# EAGLE schematic tiny_function_generator_w_output_filter (EAGLE 7.7.0)
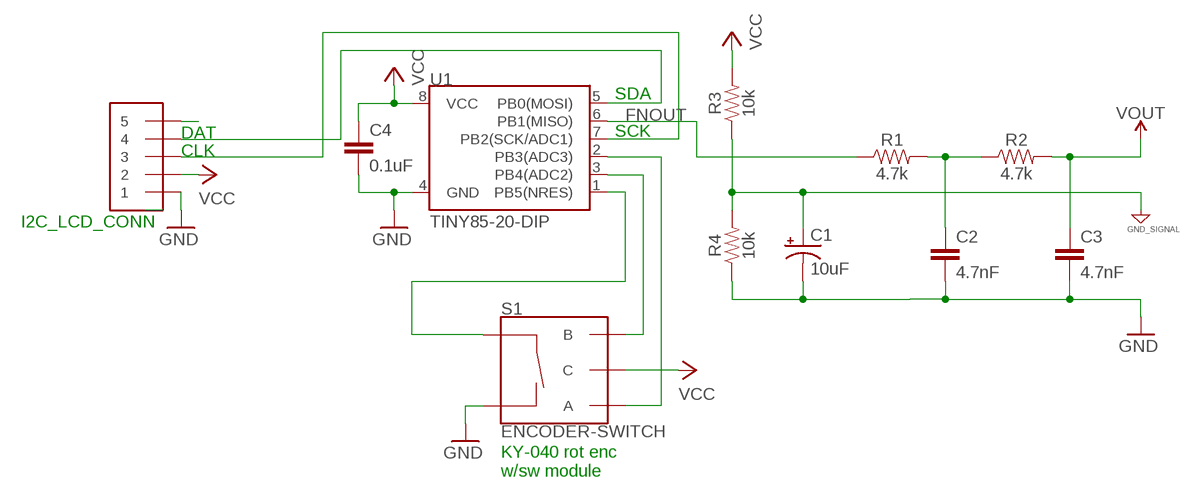
[diagram p0: schematic, sheet 1]

## Parts
C1  10uF  10UF-POLAR-RADIAL-2.5MM-25V-20%  [CPOL-RADIAL-2.5MM-5MM]
C2  4.7nF  4.7NF-50V-10%(0603)  [0603]
C3  4.7nF  4.7NF-50V-10%(0603)  [0603]
C4  0.1uF  0.1UF-KIT-EZ-50V-20%  [CAP-PTH-SMALL-KIT]
J1  1X5  [3.5MM-5P]
R1  4.7k  4.7KOHM-0603-1/10W-1%  [0603]
R2  4.7k  4.7KOHM-0603-1/10W-1%  [0603]
R3  10k  10KOHM-HORIZ-1/6W-5%  [AXIAL-0.3]
R4  10k  10KOHM-HORIZ-1/6W-5%  [AXIAL-0.3]
S1  ENCODER-SWITCH  [ROTARY_ENC_PLAIN]
U1  TINY85-20-DIP  ATTINY45TINY85-20-DIP  [DIP08_MCU]

## Nets
AGND: C1.1(+) R3.P$1 R4.P$2 ; supply symbol labelled GND_SIGNAL
FNOUT: R1.1 U1.6(PB1(MISO))
GND: C1.2(-) C2.2 C3.2 C4.2 J1.1 R4.P$1 S1.SW- U1.4(GND)
N$1: J1.3 U1.7(PB2(SCK/ADC1))
N$2: J1.4 U1.5(PB0(MOSI))
N$3: C2.1 R1.2 R2.1
N$5: S1.A U1.2(PB3(ADC3))
N$6: S1.B U1.3(PB4(ADC2))
N$7: S1.SW+ U1.1(PB5(NRES))
N$9: J1.5
VCC: C4.1 J1.2 R3.P$2 S1.C U1.8(VCC)
VOUT: C3.1 R2.2

## Notes on the sheet
- SDA
- DAT | SCK
- CLK
- I2C_LCD_CONN
- KY-040 rot enc 
  w/sw module

## Library data of the parts
C1 = SparkFun-Capacitors:10UF-POLAR: 10.0µF polarized capacitors A capacitor is a passive two-terminal electrical component used to store electrical energy temporarily in an electric field.; PROD_ID: CAP-08440
C2 C3 = SparkFun-Retired:4.7NF-50V-10%(0603): CAP-11378; PROD_ID: CAP-11378
C4 = SparkFun-Capacitors:0.1UF: 0.1µF ceramic capacitors A capacitor is a passive two-terminal electrical component used to store electrical energy temporarily in an electric field.; PROD_ID: CAP-08370
J1 = adafruit:1X5
R1 R2 = SparkFun-Resistors:4.7KOHM: 4.7kΩ resistor A resistor is a passive two-terminal electrical component that implements electrical resistance as a circuit element. Resistors act to reduce current flow, and, at the same time, act to lower voltage levels within circuits. - Wikipedia; PROD_ID: RES-07857
R3 R4 = SparkFun-Resistors:10KOHM: 10kΩ resistor A resistor is a passive two-terminal electrical component that implements electrical resistance as a circuit element. Resistors act to reduce current flow, and, at the same time, act to lower voltage levels within circuits. - Wikipedia; PROD_ID: RES-08375
S1 = SparkFun-Switches:ENCODER-SWITCH: Rotary Encoder w/ Select Switch Encoders rotate similarly to potentiometers, but they’re different from potentiometers in that an encoder has full rotation without limits. They output gray code so that you can tell how much and in which direction the encoder has been turned. This encoder includes a push-down select switch built into the shaft. SparkFun Products Rotary Encoder <https://www.sparkfun.com/products/9117> (COM-09117); SF_SKU: COM-09117
U1 = SparkFun-Retired:ATTINY45: Atmel 8-pin 2/4/8kB flash uC Retired; PROD_ID: IC-09445